# Altium schematic sheet TLV70433DBVR.schdoc
size 127 x 101 mm
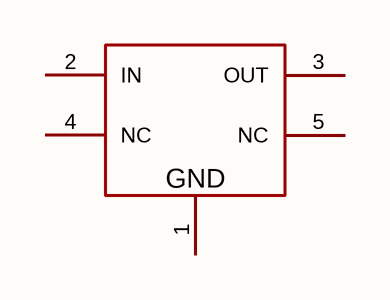
[diagram p0: TLV70433DBVR.schdoc]

## Parts
U?  tlv70433dbvr  [SOT-23-5_L3.0-W1.7-P0.95-LS2.8-BR]  (value not drawn)

## Nets

Not connected (* = marked no-connect by the designer): U? 1(GND) 2(IN) 3(OUT) 4(NC) 5(NC)

## Library data of the parts
U? = tlv70433dbvr: 输出极性:正极;工作电压:24V;输出电压:3.3V;输出电流:150mA;电源纹波抑制比(PSRR):60dB@(100kHz);输出类型:固定;; Manufacturer: TI(德州仪器); AddInBom: yes; ModelId: 0a2a1b8f50944f73965918ad6e5fe167; ModelName: SOT-23-5_L2.9-W1.6-H1.1-LS2.8-P0.95; ModelTransform: 114.173,109.636,0,180,0,0,0,0,0; Output Configuration: 正极; Voltage - Supply: 24V; Output Voltage: 3.3V; Output Current: 150mA; Voltage Dropout: 850mV@(100mA); standby current: 3.2uA; Output Type: 固定; Number of Outputs: 1; Symbol: TLV70433DBVR; LCSC Part Name: 3.3V 150mA 24V; SupplierPart: C94917; ManufacturerPart: TLV70433DBVR; Supplier Footprint: SOT-23-5; JLCPCB Part Class: Extended Part; Datasheet: https://www.ti.com/cn/lit/ds/symlink/tlv704.pdf; Supplier: LCSC; ConvertToPcb: yes; FootprintName: SOT-23-5_L3.0-W1.7-P0.95-LS2.8-BR; Power Supply Rejection Ratio (PSRR): 60dB@(100kHz); Noise: -; Features: 短路保护；过流保护；使能控制; Operating Temperature: -40℃~+125℃@(Tj)